# Altium project BJTs.PrjPcb
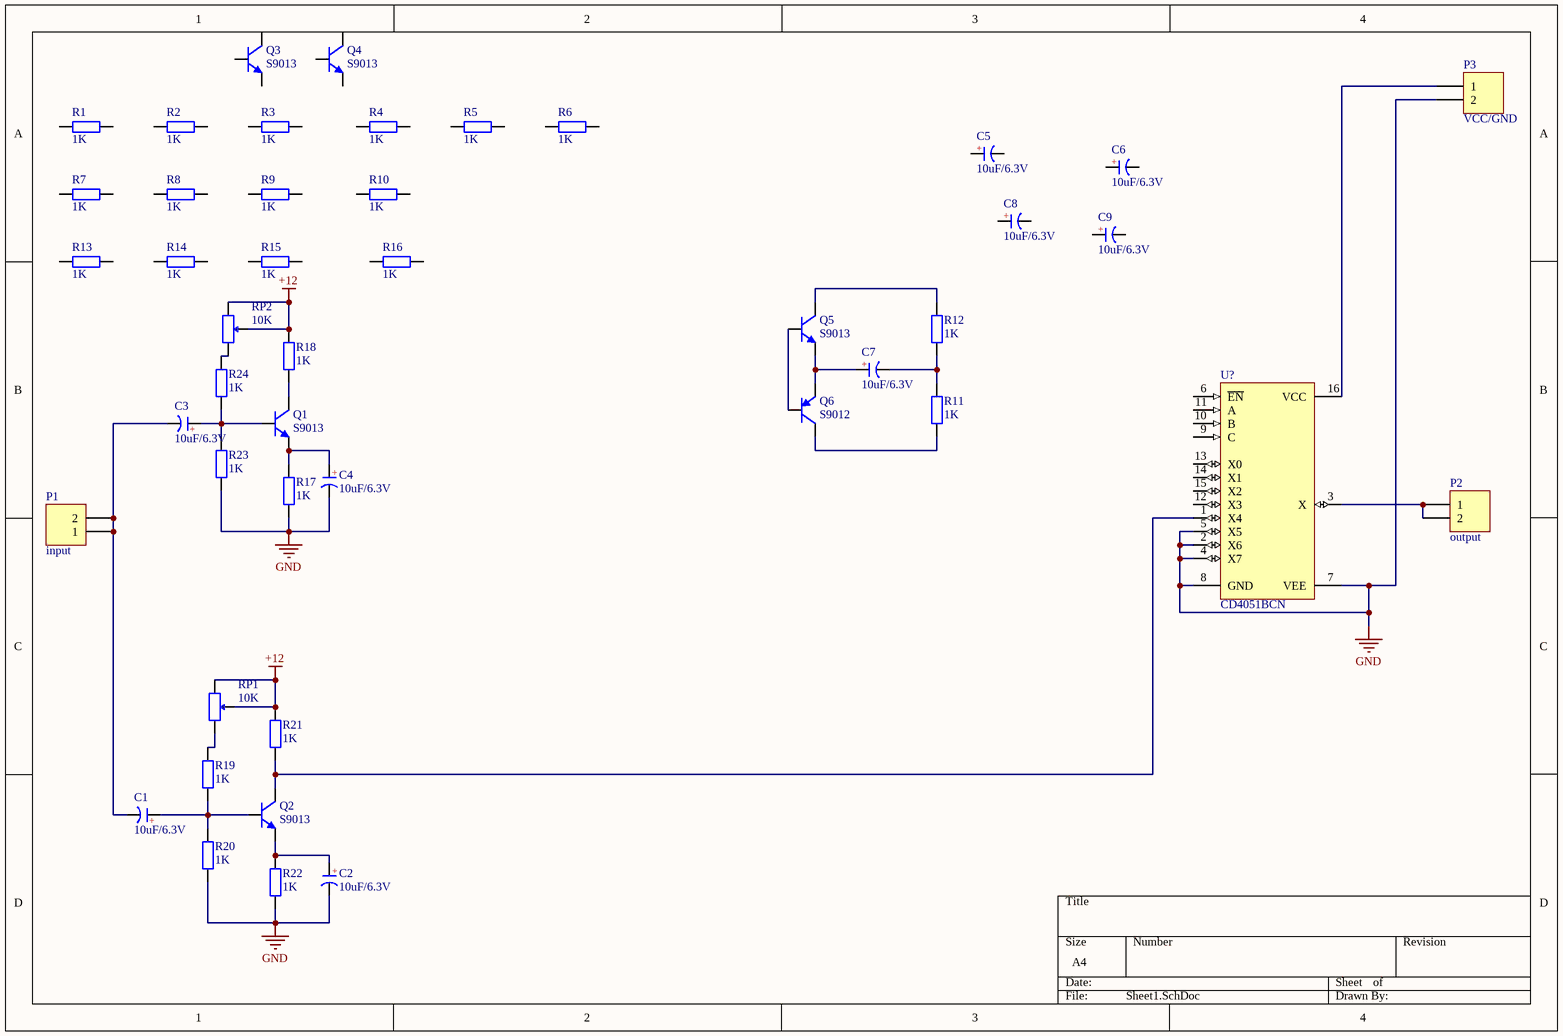
[diagram p0: Sheet1.SchDoc]
1 sheet, 45 parts. Net scope: global (net labels, ports and power ports of the same name join across sheets).
Board file: PCB1.PcbDoc

## Sheet Sheet1.SchDoc
size A4; SheetNumber: 1; SheetTotal: 1

### Parts
C1  10uF/6.3V  [CS 2.0*5*8 - C]
C2  10uF/6.3V  [CS 2.0*5*8 - C]
C3  10uF/6.3V  [CS 2.0*5*8 - C]
C4  10uF/6.3V  [CS 2.0*5*8 - C]
C5  10uF/6.3V  [CS 2.0*5*8 - C]
C6  10uF/6.3V  [CS 2.0*5*8 - C]
C7  10uF/6.3V  [CS 2.0*5*8 - C]
C8  10uF/6.3V  [CS 2.0*5*8 - C]
C9  10uF/6.3V  [CS 2.0*5*8 - C]
P1  input  [HDR1X2]
P2  output  [HDR1X2]
P3  VCC/GND  [HDR1X2]
Q1  S9013  [TO92A]
Q2  S9013  [TO92A]
Q3  S9013  [TO92A]
Q4  S9013  [TO92A]
Q5  S9013  [TO92A]
Q6  S9012  [TO92A]
R1  1K  [RS 1/4W]
R2  1K  [RS 1/4W]
R3  1K  [RS 1/4W]
R4  1K  [RS 1/4W]
R5  1K  [RS 1/4W]
R6  1K  [RS 1/4W]
R7  1K  [RS 1/4W]
R8  1K  [RS 1/4W]
R9  1K  [RS 1/4W]
R10  1K  [RS 1/4W]
R11  1K  [RS 1/4W]
R12  1K  [RS 1/4W]
R13  1K  [RS 1/4W]
R14  1K  [RS 1/4W]
R15  1K  [RS 1/4W]
R16  1K  [RS 1/4W]
R17  1K  [RS 1/4W]
R18  1K  [RS 1/4W]
R19  1K  [RS 1/4W]
R20  1K  [RS 1/4W]
R21  1K  [RS 1/4W]
R22  1K  [RS 1/4W]
R23  1K  [RS 1/4W]
R24  1K  [RS 1/4W]
RP1  10K  [3296W]
RP2  10K  [3296W]
U?  CD4051BCN  [N16E]

### Nets
+12: R18.2 R21.2 RP1.1 RP1.2 RP2.1 RP2.2
GND: C2.2(K) C4.2(K) P3.2 R17.1 R20.1 R22.1 R23.1 U?.2(X6) U?.4(X7) U?.5(X5) U?.7(VEE) U?.8(GND)
NetC1_1: C1.1(A) Q2.2(B) R19.1 R20.2
NetC1_2: C1.2(K) C3.2(K) P1.1 P1.2
NetC2_1: C2.1(A) Q2.1(E) R22.2
NetC3_1: C3.1(A) Q1.2(B) R23.2 R24.1
NetC4_1: C4.1(A) Q1.1(E) R17.2
NetC7_1: C7.1(A) Q5.1(E) Q6.1(E)
NetC7_2: C7.2(K) R11.2 R12.1
NetP2_1: P2.1 P2.2 U?.3(X)
NetP3_1: P3.1 U?.16(VCC)
NetQ1_3: Q1.3(C) R18.1
NetQ2_3: Q2.3(C) R21.1 U?.1(X4)
NetQ5_2: Q5.2(B) Q6.2(B)
NetQ5_3: Q5.3(C) R12.2
NetQ6_3: Q6.3(C) R11.1
NetR19_2: R19.2 RP1.3
NetR24_2: R24.2 RP2.3

Not connected (* = marked no-connect by the designer): C5 1(A) 2(K); C6 1(A) 2(K); C8 1(A) 2(K); C9 1(A) 2(K); Q3 1(E) 2(B) 3(C); Q4 1(E) 2(B) 3(C); R1 1 2; R2 1 2; R3 1 2; R4 1 2; R5 1 2; R6 1 2; R7 1 2; R8 1 2; R9 1 2; R10 1 2; R13 1 2; R14 1 2; R15 1 2; R16 1 2; U? 6(~{EN}) 9(C) 10(B) 11(A) 12(X3) 13(X0) 14(X1) 15(X2)

### Notes on the sheet
- (in symbol C-CS) +

### Library data of the parts
C1-C9 = C-CS: 直插固态电容; 版权归属: 源创客; BOM名称: 直插固态电容; 学习资源: www.ooocke.com
P1-P3 = Header 2: Header, 2-Pin; LatestRevisionDate: 17-Jul-2002; LatestRevisionNote: Re-released for DXP Platform.; Publisher: Altium Limited
Q1-Q5 = 9013-DIP: 低频放大-NPN型; 版权归属: 源创客; 属性: 50V 0.5A 0.625W; BOM名称: 低频放大-NPN型; 学习资源: www.ooocke.com
Q6 = 9012-DIP: 低频放大-PNP型; 版权归属: 源创客; 属性: 50V 0.5A 0.625W; BOM名称: 低频放大-PNP型; 学习资源: www.ooocke.com
R1-R24 = R-CRR: 直插色环电阻; BOM名称: 色环电阻; 版权归属: 源创客; 学习资源: www.ooocke.com
RP1 RP2 = RP-ID: 插件单联电位器; BOM名称: 插件电位器; 版权归属: 源创客; 学习资源: www.ooocke.com
U? = CD4051BCN: 8-Channel Analog Multiplexer/Demultiplexer; Published: 17-Jul-2002; LatestRevisionDate: 29-May-2009; LatestRevisionNote: Component Body Added.; DatasheetVersion: Jan-1999; PackageVersion: 2000; PackageReference: N16E; Publisher: Altium Limited; PackageDescription: DIP, 16-Pin, Row Spacing 7.62 mm, Pitch 2.54 mm; ComponentLink1Description: Manufacturer Link; ComponentLink1URL: http://www.fairchildsemi.com/; ComponentLink2Description: Datasheet; ComponentLink2URL: http://www.fairchildsemi.com/ds/CD%2FCD4052BC.pdf